# Altium schematic sheet BottomBoard.SchDoc
size 260 x 358 mm; Origin: Eagle; OriginPath: C:\Users\Bimbo\Downloads\ELM327-based OBD-II interface.sch; OriginSheet: 1
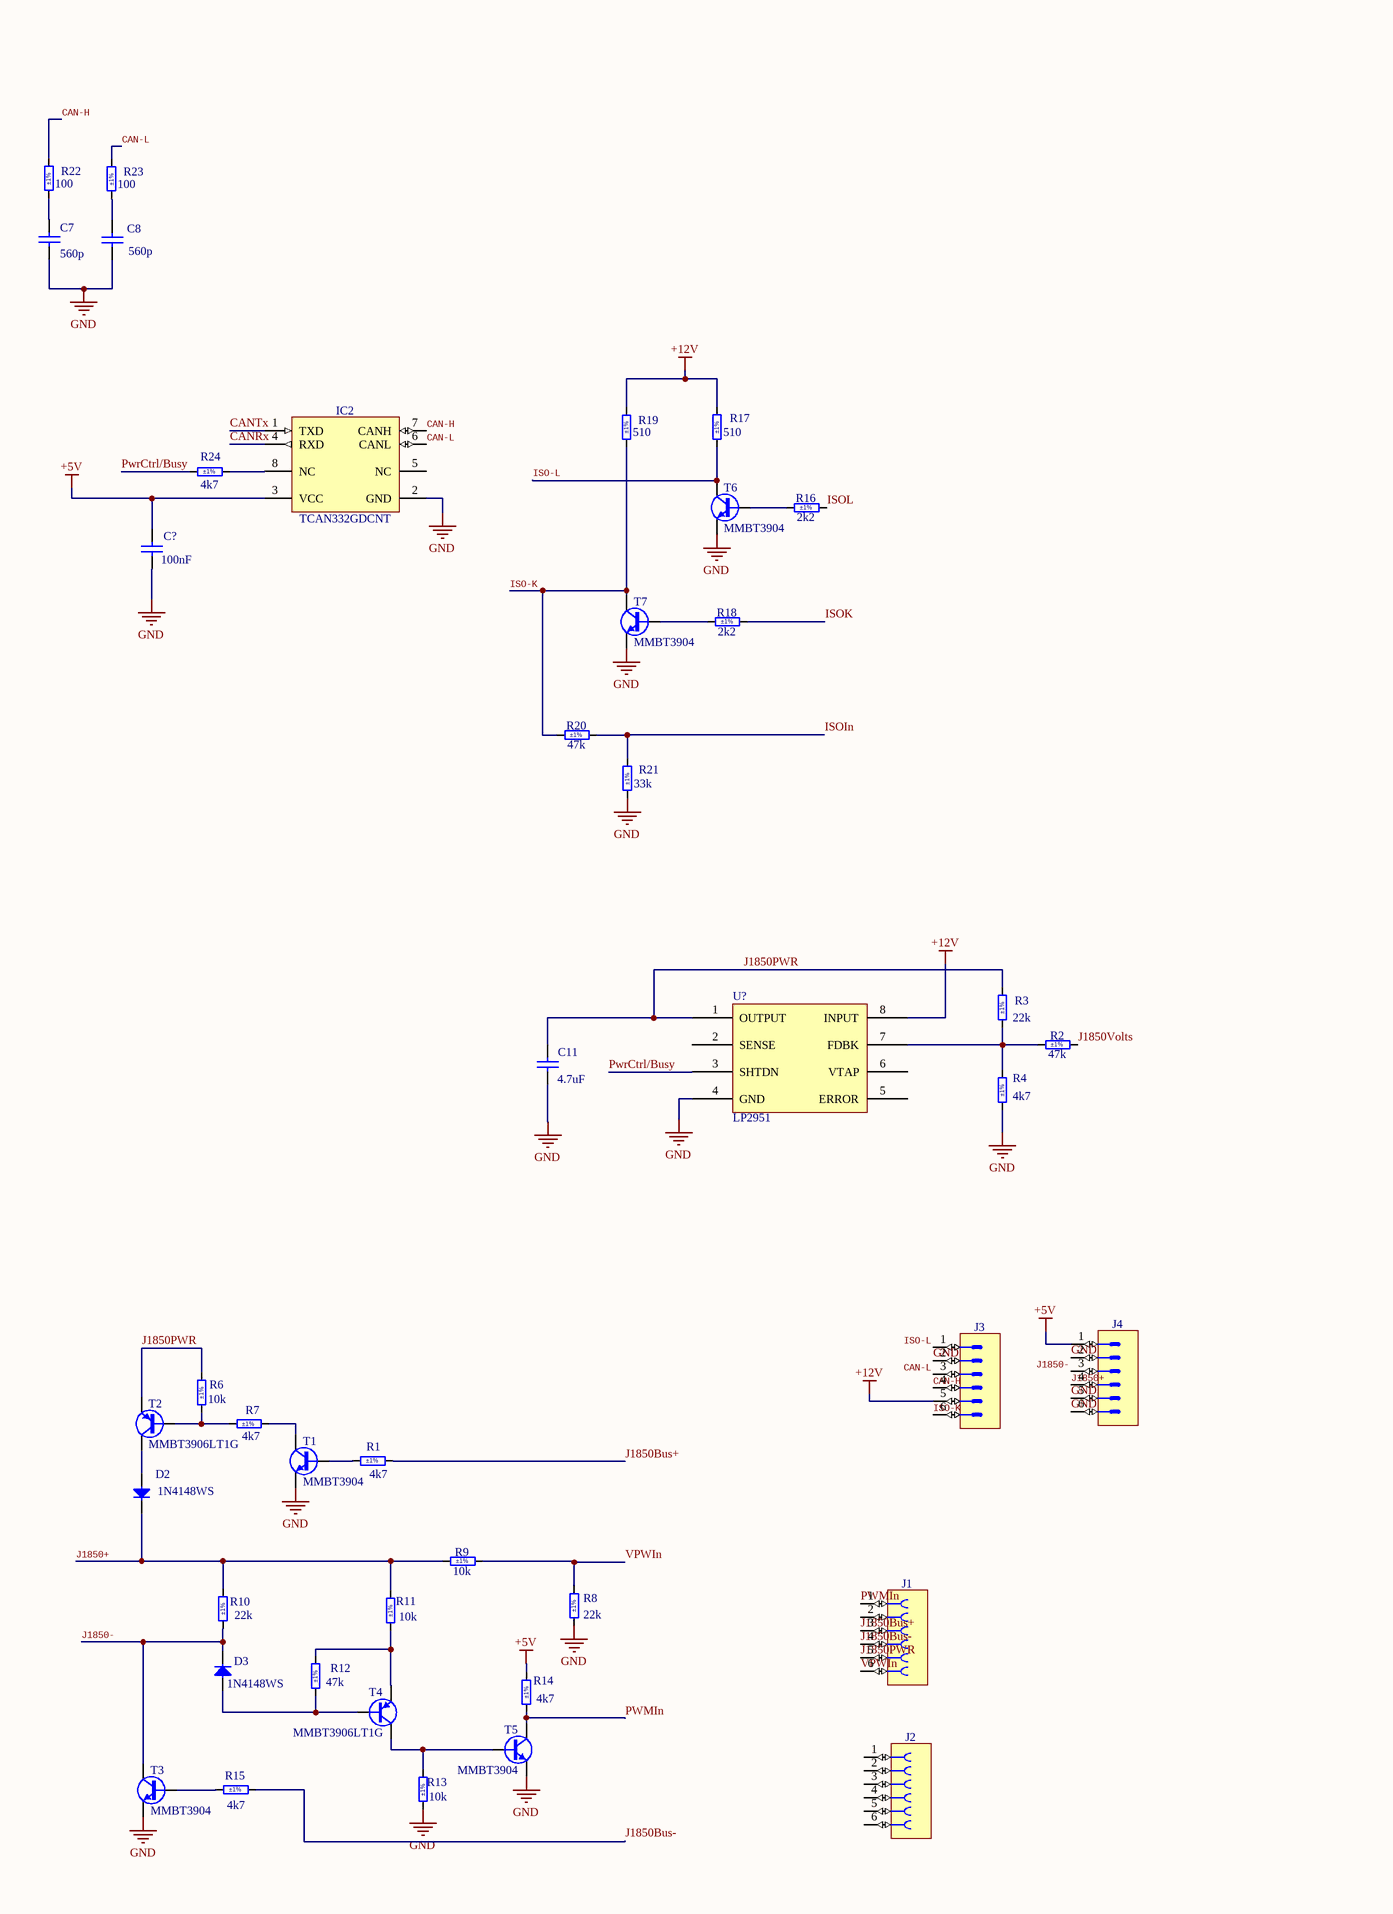
[diagram p0: BottomBoard.SchDoc]

## Parts
C7  560p  [CAPC2012X135N]
C8  560p  [CAPC2012X135N]
C11  4.7uF  [CAPC2012X145N]
C?  100nF  [CAPC2012X135N]
D2  1N4148WS  [SODFL2512X100N]
D3  1N4148WS  [SODFL2512X100N]
IC2  TCAN332GDCNT  [SOT65P280X145-8N]
J1  Socket 6  [3M_929974-01-06-RK]  (value not drawn)
J2  Socket 6  [3M_929974-01-06-RK]  (value not drawn)
J3  Header 6  [3M_961106-6404-AR]  (value not drawn)
J4  Header 6  [3M_961106-6404-AR]  (value not drawn)
R1  4k7  Tolerance: ±1%  [RESC2012X60N]
R2  47k  Tolerance: ±1%  [RESC2012X60N]
R3  22k  Tolerance: ±1%  [RESC2012X60N]
R4  4k7  Tolerance: ±1%  [RESC2012X60N]
R6  10k  Tolerance: ±1%  [RESC2012X60N]
R7  4k7  Tolerance: ±1%  [RESC2012X60N]
R8  22k  Tolerance: ±1%  [RESC2012X60N]
R9  10k  Tolerance: ±1%  [RESC2012X60N]
R10  22k  Tolerance: ±1%  [RESC2012X60N]
R11  10k  Tolerance: ±1%  [RESC2012X60N]
R12  47k  Tolerance: ±1%  [RESC2012X60N]
R13  10k  Tolerance: ±1%  [RESC2012X60N]
R14  4k7  Tolerance: ±1%  [RESC2012X60N]
R15  4k7  Tolerance: ±1%  [RESC2012X60N]
R16  2k2  Tolerance: ±1%  [RESC2012X60N]
R17  510  Tolerance: ±1%  [RESC2012X60N]
R18  2k2  Tolerance: ±1%  [RESC2012X60N]
R19  510  Tolerance: ±1%  [RESC2012X60N]
R20  47k  Tolerance: ±1%  [RESC2012X60N]
R21  33k  Tolerance: ±1%  [RESC2012X60N]
R22  100  Tolerance: ±1%  [RESC2012X60N]
R23  100  Tolerance: ±1%  [RESC2012X60N]
R24  4k7  Tolerance: ±1%  [RESC2012X60N]
T1  MMBT3904  [SOT95P230X110-3N]
T2  MMBT3906LT1G  [SOT95P240X110-3N]
T3  MMBT3904  [SOT95P230X110-3N]
T4  MMBT3906LT1G  [SOT95P240X110-3N]
T5  MMBT3904  [SOT95P230X110-3N]
T6  MMBT3904  [SOT95P230X110-3N]
T7  MMBT3904  [SOT95P230X110-3N]
U?  LP2951  [25Q64]

## Nets
+5V: C?.2 IC2.3(VCC) J4.1 R14.2
+12V: J3.5 R17.2 R19.2 U?.8(INPUT)
GND: C7.1 C8.1 C11.1 C?.1 IC2.2(GND) J3.2 J4.2 J4.5 J4.6 R4.1 R8.1 R13.1 R21.1 T1.2(E) T3.2(E) T5.2(E) T6.2(E) T7.2(E) U?.4(GND)
CAN-H: IC2.7(CANH) J3.4 R22.2
CAN-L: IC2.6(CANL) J3.3 R23.2
CANRx: IC2.4(RXD)
CANTx: IC2.1(TXD)
ISO-K: J3.6 R19.1 R20.1 T7.3(C)
ISO-L: J3.1 R17.1 T6.3(C)
ISOIn: R20.2 R21.2
ISOK: R18.2
ISOL: R16.2
J1850+: D2.1(C) J4.4 R9.1 R10.2 R11.2
J1850-: D3.1(C) J4.3 R10.1 T3.3(C)
J1850Bus+: J1.3 R1.2
J1850Bus-: J1.4 R15.2
J1850PWR: C11.2 J1.5 R3.2 R6.2 T2.2(E) U?.1(OUTPUT)
J1850Volts: R2.2
PWMIn: J1.1 R14.1 T5.3(C)
PwrCtrl/Busy: R24.2 U?.3(SHTDN)
VPWIn: J1.6 R8.2 R9.2
NetC7_2: C7.2 R22.1
NetC8_2: C8.2 R23.1
NetD2_2: D2.2(A) T2.3(C)
NetD3_2: D3.2(A) R12.1 T4.1(B)
NetIC2_8: IC2.8(NC) R24.1
NetR1_1: R1.1 T1.1(B)
NetR2_1: R2.1 R3.1 R4.2 U?.7(FDBK)
NetR6_1: R6.1 R7.2 T2.1(B)
NetR7_1: R7.1 T1.3(C)
NetR11_1: R11.1 R12.2 T4.2(E)
NetR13_2: R13.2 T4.3(C) T5.1(B)
NetR15_1: R15.1 T3.1(B)
NetR16_1: R16.1 T6.1(B)
NetR18_1: R18.1 T7.1(B)

Not connected (* = marked no-connect by the designer): IC2 5(NC); J1 2; J2 1 2 3 4 5 6; U? 2(SENSE) 5(ERROR) 6(VTAP)

## Library data of the parts
C7 C8 C? = CC0805_100NF_50V_10%_X7R: Non-polarised capacitor; Part Description: SMD Multilayer Chip Ceramic Capacitor; Manufacturer: GENERIC; Manufacturer1 Part Number: C2012X7R1H104K085; Voltage: 50V; TC: X7R; Tolerance: ±10%; Part Number: CC0805_100NF_50V_10%_X7R; Component Kind: Standard; Component Type: Standard; Pin Count: 2; Status: Preferred; Manufacturer Part Number: CC0805_100NF_50V_10%_X7R; Case: 0805; Mounted: Yes; Socket: No; SMD: Yes; Sense: No; Manufacturer1 Example: TDK; Manufacturer1 ComponentHeight: 1mm; HelpURL: \\cern.ch\dfs\Applications\Altium\Datasheets\CC0805_X7R_TDK_C.pdf; Author: CERN DEM JLC; CreateDate: 03.12.2007; LatestRevisionDate: 22.04.2015
  C7 C8: Value: 560p
  C?: Value: 100nF
C11 = CC0805_4.7UF_50V_10%_X7R: Non-polarised capacitor; Part Description: SMD Multilayer Chip Ceramic Capacitor; Manufacturer: GENERIC; Manufacturer1 Part Number: C2012X7R1H475K125; Voltage: 50V; TC: X7R; Tolerance: ±10%; Part Number: CC0805_4.7UF_50V_10%_X7R; Component Kind: Standard; Component Type: Standard; Pin Count: 2; Value: 4.7uF; Status: Preferred; Manufacturer Part Number: CC0805_4.7UF_50V_10%_X7R; Case: 0805; Mounted: Yes; Socket: No; SMD: Yes; Sense: No; Manufacturer1 Example: TDK; Manufacturer1 ComponentHeight: 1.45mm; HelpURL: \\cern.ch\dfs\Applications\Altium\Datasheets\CC0805_X7R_TDK_C.pdf; Author: CERN DEM JMW; CreateDate: 30.07.2021; LatestRevisionDate: 30.07.2021
D2 D3 = 1N4148WS: Diode; Part Description: Small Signal Diodes; Manufacturer: FAIRCHILD SEMICONDUCTOR; Voltage: 75V; Power: 150mA; PressFit: No; Bonding: No; Part Number: 1N4148WS; Component Kind: Standard; Component Type: Standard; Device: 1N4148WS; PackageDescription: SODFL Diode (SOD323F); 1.70mm W X 1.25mm L X 1.00mm H body, IPC Medium Density; Manufacturer Part Number: 1N4148WS; Pin Count: 2; Case: SOD-323F; Mounted: Yes; Socket: No; SMD: Yes; Sense: No; ComponentHeight: 1mm; HelpURL: \\cern.ch\dfs\Applications\Altium\Datasheets\1N4148WS.pdf; Author: CERN DEM JLC; CreateDate: 12.05.2011; LatestRevisionDate: 12.05.2011
IC2 = TCAN332GDCNT: 3.3V CAN Transceivers with CAN FD (Flexible Data Rate); Manufacturer: TEXAS INSTRUMENTS; PressFit: No; Bonding: No; Part Number: TCAN332GDCNT; Component Kind: Standard; Component Type: Standard; Device: TCAN332GDCNT; PackageDescription: SOT, 0.65mm Pitch; 8 pin, 1.625mm W X 2.90mm L X 1.45mm H body, IPC Medium Density; Part Description: 3.3V CAN Transceivers with CAN FD (Flexible Data Rate); Manufacturer Part Number: TCAN332GDCNT; Pin Count: 8; Case: SOT23-8; Mounted: Yes; Socket: No; SMD: Yes; Sense: No; ComponentHeight: 1.45mm; Author: CERN DEM JLC; HelpURL: \\cern.ch\dfs\Applications\Altium\Datasheets\TCAN332GDCNT.pdf; CreateDate: 22.08.2017; LatestRevisionDate: 22.08.2017
J1 J2 = 3M_929974-01-06-RK: Connector 6 Female; Part Description: 6 Contacts, Straight .100" x .100" Boardmount Socket, 929 Series; Manufacturer: 3M; PressFit: No; Part Number: 3M_929974-01-06-RK; Component Kind: Standard; Component Type: Standard; Pin Count: 6; Family: Socket 6; Mounted: Yes; Socket: No; SMD: No; Sense: No; Status: None; Manufacturer Part Number: 929974-01-06-RK; ComponentHeight: 8.26mm; HelpURL: \\cern.ch\dfs\Applications\Altium\Datasheets\3M_929974-01-06-RK.pdf; Author: CERN DEM JMW; CreateDate: 31.08.2016; LatestRevisionDate: 31.08.2016
J3 J4 = 3M_961106-6404-AR: Connector 6 Male; Part Description: 6 Contacts, Straight .100" x .100" Pin Strip Header, 961 Series; Manufacturer: 3M; PressFit: No; Part Number: 3M_961106-6404-AR; Component Kind: Standard; Component Type: Standard; Pin Count: 6; Family: Header 6; Mounted: Yes; Socket: No; SMD: No; Sense: No; Status: None; Manufacturer Part Number: 961106-6404-AR; ComponentHeight: 8mm; HelpURL: \\cern.ch\dfs\Applications\Altium\Datasheets\3M_961106-6404-AR.pdf; Author: CERN DEM MR; CreateDate: 05.09.2016; LatestRevisionDate: 05.09.2016
R1 R4 R7 R12 R14 R15 R24 = R0805_4K7_1%_0.125W_100PPM: Resistor - 1%; Part Description: General Purpose Thick Film Chip Resistor; Manufacturer: GENERIC; Manufacturer1 Part Number: NRC10F4701TRF; Power: 0.125W; TC: ±100ppm/°C; PressFit: No; Part Number: R0805_4K7_1%_0.125W_100PPM; Component Kind: Standard; Component Type: Standard; Pin Count: 2; Status: Preferred; Manufacturer Part Number: R0805_4K7_1%_0.125W_100PPM; Case: 0805; Mounted: Yes; Sense: No; Socket: No; SMD: Yes; Manufacturer1 Example: NIC COMPONENT; Manufacturer1 ComponentHeight: 0.6mm; HelpURL: \\cern.ch\dfs\Applications\Altium\Datasheets\R0805_NIC_NRC.pdf; Author: CERN DEM JLC; CreateDate: 03.12.2007; LatestRevisionDate: 13.03.2008
  R1 R4 R7 R14 R15 R24: Value: 4k7
  R12: Value: 47k
R2 = R0805_47K_1%_0.125W_100PPM: Resistor - 1%; Part Description: General Purpose Thick Film Chip Resistor; Manufacturer: GENERIC; Manufacturer1 Part Number: NRC10F4702TRF; Power: 0.125W; TC: ±100ppm/°C; PressFit: No; Part Number: R0805_47K_1%_0.125W_100PPM; Component Kind: Standard; Component Type: Standard; Pin Count: 2; Value: 47k; Status: Preferred; Manufacturer Part Number: R0805_47K_1%_0.125W_100PPM; Case: 0805; Mounted: Yes; Sense: No; Socket: No; SMD: Yes; Manufacturer1 Example: NIC COMPONENT; Manufacturer1 ComponentHeight: 0.6mm; HelpURL: \\cern.ch\dfs\Applications\Altium\Datasheets\R0805_NIC_NRC.pdf; Author: CERN DEM JLC; CreateDate: 03.12.2007; LatestRevisionDate: 13.03.2008
R3 = R0805_22K_1%_0.125W_100PPM: Resistor - 1%; Part Description: General Purpose Thick Film Chip Resistor; Manufacturer: GENERIC; Manufacturer1 Part Number: NRC10F2202TRF; Power: 0.125W; TC: ±100ppm/°C; PressFit: No; Part Number: R0805_22K_1%_0.125W_100PPM; Component Kind: Standard; Component Type: Standard; Pin Count: 2; Value: 22k; Status: Preferred; Manufacturer Part Number: R0805_22K_1%_0.125W_100PPM; Case: 0805; Mounted: Yes; Sense: No; Socket: No; SMD: Yes; Manufacturer1 Example: NIC COMPONENT; Manufacturer1 ComponentHeight: 0.6mm; HelpURL: \\cern.ch\dfs\Applications\Altium\Datasheets\R0805_NIC_NRC.pdf; Author: CERN DEM JLC; CreateDate: 03.12.2007; LatestRevisionDate: 13.03.2008
R6 R9 R11 R13 = R0805_10K_1%_0.125W_100PPM: Resistor - 1%; Part Description: General Purpose Thick Film Chip Resistor; Manufacturer: GENERIC; Manufacturer1 Part Number: NRC10F1002TRF; Power: 0.125W; TC: ±100ppm/°C; PressFit: No; Part Number: R0805_10K_1%_0.125W_100PPM; Component Kind: Standard; Component Type: Standard; Pin Count: 2; Value: 10k; Status: Preferred; Manufacturer Part Number: R0805_10K_1%_0.125W_100PPM; Case: 0805; Mounted: Yes; Sense: No; Socket: No; SMD: Yes; Manufacturer1 Example: NIC COMPONENT; Manufacturer1 ComponentHeight: 0.6mm; HelpURL: \\cern.ch\dfs\Applications\Altium\Datasheets\R0805_NIC_NRC.pdf; Author: CERN DEM JLC; CreateDate: 03.12.2007; LatestRevisionDate: 13.03.2008
R8 R10 R16-R23 = R0805_2K2_1%_0.125W_100PPM: Resistor - 1%; Part Description: General Purpose Thick Film Chip Resistor; Manufacturer: GENERIC; Manufacturer1 Part Number: NRC10F2201TRF; Power: 0.125W; TC: ±100ppm/°C; PressFit: No; Part Number: R0805_2K2_1%_0.125W_100PPM; Component Kind: Standard; Component Type: Standard; Pin Count: 2; Status: Preferred; Manufacturer Part Number: R0805_2K2_1%_0.125W_100PPM; Case: 0805; Mounted: Yes; Sense: No; Socket: No; SMD: Yes; Manufacturer1 Example: NIC COMPONENT; Manufacturer1 ComponentHeight: 0.6mm; HelpURL: \\cern.ch\dfs\Applications\Altium\Datasheets\R0805_NIC_NRC.pdf; Author: CERN DEM JLC; CreateDate: 03.12.2007; LatestRevisionDate: 13.03.2008
  R8 R10: Value: 22k
  R16 R18: Value: 2k2
  R17 R19: Value: 510
  R20: Value: 47k
  R21: Value: 33k
  R22 R23: Value: 100
T1 T3 T5-T7 = MMBT3904: NPN Transistor; Part Description: 40V 200mA NPN Switching Transistor; Manufacturer: NEXPERIA; PressFit: No; Bonding: No; Part Number: MMBT3904; Component Kind: Standard; Component Type: Standard; Device: MMBT3904; PackageDescription: SOT23, 0.95mm Pitch; 3 Pin, 1.30mm W X 2.90mm L X 1.10mm H body, IPC Medium Density; Manufacturer Part Number: MMBT3904; Pin Count: 3; Case: SOT23-3; Mounted: Yes; Socket: No; SMD: Yes; Sense: No; ComponentHeight: 1.1mm; HelpURL: \\cern.ch\dfs\Applications\Altium\Datasheets\MMBT3904.pdf; Author: CERN DEM JLC; CreateDate: 10.02.2010; LatestRevisionDate: 16.09.2021
T2 T4 = MMBT3906LT1G: PNP Transistor; Part Description: 40V 200mA PNP General Purpose Transistor; Manufacturer: ON SEMICONDUCTOR; PressFit: No; Bonding: No; Part Number: MMBT3906LT1G; Component Kind: Standard; Component Type: Standard; Device: MMBT3906LT1G; PackageDescription: SOT23, 0.95mm Pitch; 3 Pin, 1.40mm W X 3.00mm L X 1.10mm H body, IPC Medium Density; Manufacturer Part Number: MMBT3906LT1G; Pin Count: 3; Case: SOT23-3; Mounted: Yes; Socket: No; SMD: Yes; Sense: No; ComponentHeight: 1.1mm; HelpURL: \\cern.ch\dfs\Applications\Altium\Datasheets\MMBT3906LT1G.pdf; Author: CERN DEM JLC; CreateDate: 29.03.2012; LatestRevisionDate: 29.03.2012